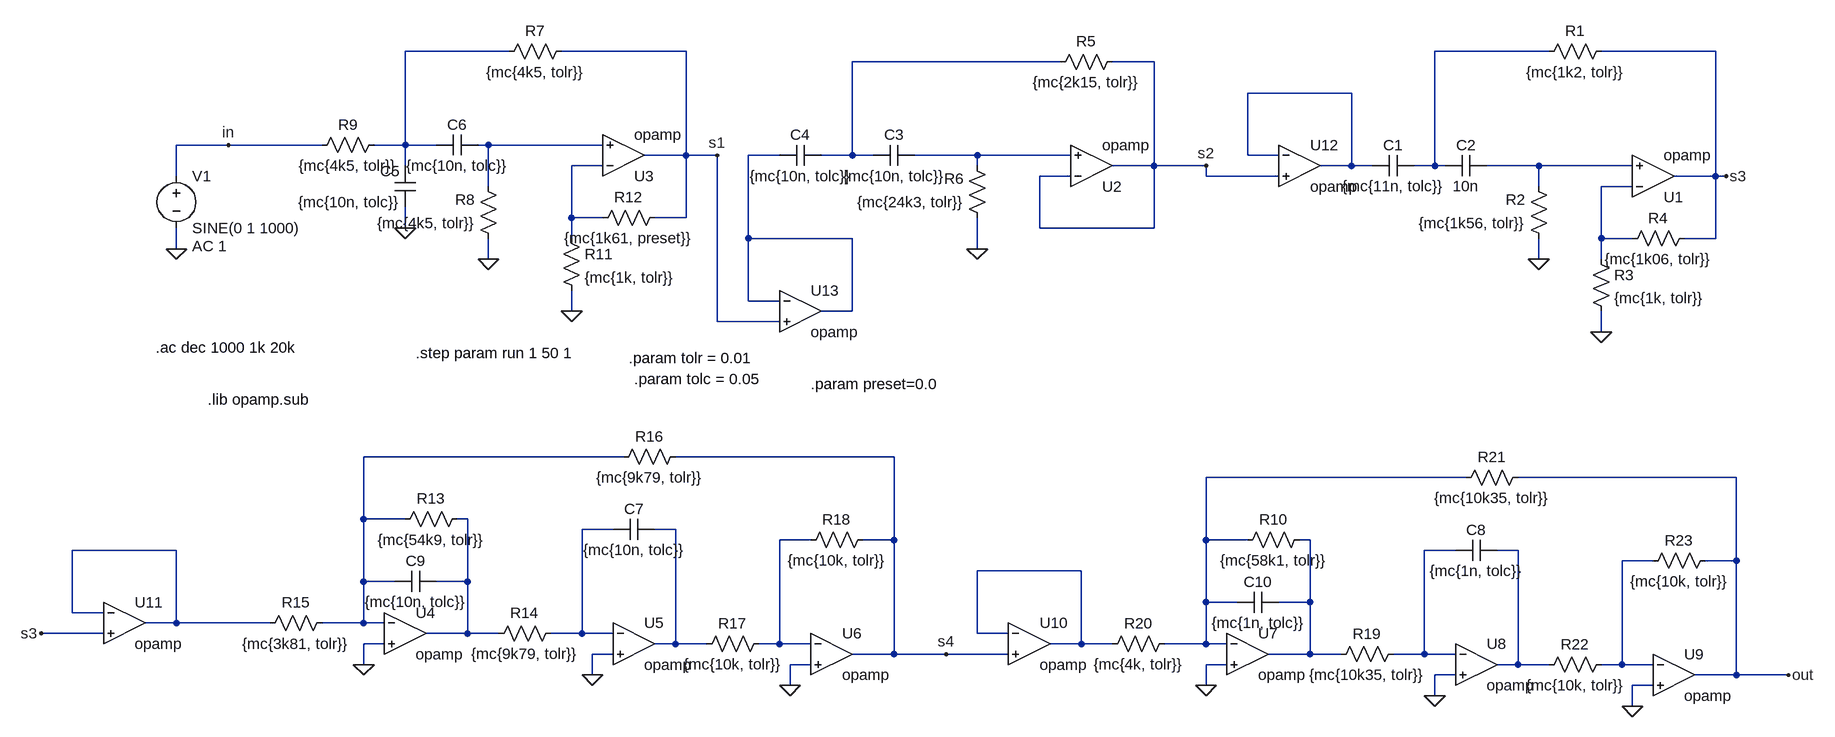
[diagram p0: schematic filtro_final.asc]
filtro_final.asc, the LTspice schematic file:
Version 4
SHEET 1 1252 1168
WIRE -1424 -48 -1584 -48
WIRE -1152 -48 -1344 -48
WIRE 176 -48 0 -48
WIRE 432 -48 256 -48
WIRE -576 -32 -896 -32
WIRE -432 -32 -496 -32
WIRE -128 16 -288 16
WIRE -1856 96 -1936 96
WIRE -1712 96 -1856 96
WIRE -1584 96 -1584 -48
WIRE -1584 96 -1632 96
WIRE -1536 96 -1584 96
WIRE -1456 96 -1472 96
WIRE -1280 96 -1456 96
WIRE -1152 112 -1152 -48
WIRE -1152 112 -1216 112
WIRE -1104 112 -1152 112
WIRE -1008 112 -1056 112
WIRE -896 112 -896 -32
WIRE -896 112 -944 112
WIRE -864 112 -896 112
WIRE -704 112 -800 112
WIRE -560 112 -704 112
WIRE -288 112 -288 16
WIRE -240 112 -288 112
WIRE -1584 128 -1584 96
WIRE -1280 128 -1328 128
WIRE -704 128 -704 112
WIRE -432 128 -432 -32
WIRE -432 128 -496 128
WIRE -352 128 -432 128
WIRE -128 128 -128 16
WIRE -128 128 -176 128
WIRE -96 128 -128 128
WIRE 0 128 0 -48
WIRE 0 128 -32 128
WIRE 16 128 0 128
WIRE 160 128 80 128
WIRE 304 128 160 128
WIRE -1936 144 -1936 96
WIRE -560 144 -608 144
WIRE -352 144 -352 128
WIRE -240 144 -352 144
WIRE 432 144 432 -48
WIRE 432 144 368 144
WIRE 448 144 432 144
WIRE -1456 160 -1456 96
WIRE 160 160 160 128
WIRE 304 160 256 160
WIRE -1328 208 -1328 128
WIRE -1280 208 -1328 208
WIRE -1152 208 -1152 112
WIRE -1152 208 -1200 208
WIRE -1584 224 -1584 192
WIRE -608 224 -608 144
WIRE -432 224 -432 128
WIRE -432 224 -608 224
WIRE -1328 240 -1328 208
WIRE -1056 240 -1056 112
WIRE -896 240 -1056 240
WIRE 256 240 256 160
WIRE 304 240 256 240
WIRE 432 240 432 144
WIRE 432 240 384 240
WIRE -1936 256 -1936 224
WIRE -704 256 -704 208
WIRE -1456 272 -1456 240
WIRE 160 272 160 240
WIRE 256 272 256 240
WIRE -1056 336 -1056 240
WIRE -1008 336 -1056 336
WIRE -1328 352 -1328 320
WIRE -896 352 -896 240
WIRE -896 352 -944 352
WIRE -1104 368 -1104 112
WIRE -1008 368 -1104 368
WIRE 256 384 256 352
WIRE -1248 576 -1648 576
WIRE -832 576 -1168 576
WIRE 48 608 -352 608
WIRE 464 608 128 608
WIRE -1648 672 -1648 576
WIRE -1584 672 -1648 672
WIRE -1488 672 -1504 672
WIRE -1264 688 -1312 688
WIRE -1168 688 -1200 688
WIRE -960 704 -1008 704
WIRE -832 704 -832 576
WIRE -832 704 -880 704
WIRE -352 704 -352 608
WIRE -288 704 -352 704
WIRE -192 704 -208 704
WIRE -1936 720 -2096 720
WIRE 32 720 -16 720
WIRE 128 720 96 720
WIRE 336 736 288 736
WIRE 464 736 464 608
WIRE 464 736 416 736
WIRE -544 752 -704 752
WIRE -1648 768 -1648 672
WIRE -1600 768 -1648 768
WIRE -1488 768 -1488 672
WIRE -1488 768 -1536 768
WIRE -352 800 -352 704
WIRE -304 800 -352 800
WIRE -192 800 -192 704
WIRE -192 800 -240 800
WIRE -2096 816 -2096 720
WIRE -2048 816 -2096 816
WIRE -1936 832 -1936 720
WIRE -1936 832 -1984 832
WIRE -1792 832 -1936 832
WIRE -1648 832 -1648 768
WIRE -1648 832 -1712 832
WIRE -1616 832 -1648 832
WIRE -2048 848 -2144 848
WIRE -1488 848 -1488 768
WIRE -1488 848 -1552 848
WIRE -1440 848 -1488 848
WIRE -1312 848 -1312 688
WIRE -1312 848 -1360 848
WIRE -1264 848 -1312 848
WIRE -704 848 -704 752
WIRE -656 848 -704 848
WIRE -1616 864 -1648 864
WIRE -1168 864 -1168 688
WIRE -1168 864 -1200 864
WIRE -1120 864 -1168 864
WIRE -1008 864 -1008 704
WIRE -1008 864 -1040 864
WIRE -960 864 -1008 864
WIRE -544 864 -544 752
WIRE -544 864 -592 864
WIRE -496 864 -544 864
WIRE -352 864 -352 800
WIRE -352 864 -416 864
WIRE -320 864 -352 864
WIRE -1264 880 -1296 880
WIRE -832 880 -832 704
WIRE -832 880 -896 880
WIRE -752 880 -832 880
WIRE -656 880 -752 880
WIRE -192 880 -192 800
WIRE -192 880 -256 880
WIRE -144 880 -192 880
WIRE -16 880 -16 720
WIRE -16 880 -64 880
WIRE 32 880 -16 880
WIRE -1648 896 -1648 864
WIRE -960 896 -992 896
WIRE -320 896 -352 896
WIRE 128 896 128 720
WIRE 128 896 96 896
WIRE 176 896 128 896
WIRE 288 896 288 736
WIRE 288 896 256 896
WIRE 336 896 288 896
WIRE -1296 912 -1296 880
WIRE 32 912 0 912
WIRE 464 912 464 736
WIRE 464 912 400 912
WIRE 544 912 464 912
WIRE -992 928 -992 896
WIRE -352 928 -352 896
WIRE 336 928 304 928
WIRE 0 944 0 912
WIRE 304 960 304 928
FLAG 256 384 0
FLAG 160 272 0
FLAG -704 256 0
FLAG -1328 352 0
FLAG -1584 224 0
FLAG -1456 272 0
FLAG -1936 256 0
FLAG -352 128 s2
FLAG 448 144 s3
FLAG -1648 896 0
FLAG -1296 912 0
FLAG -992 928 0
FLAG -752 880 s4
FLAG -1856 96 in
FLAG -352 928 0
FLAG 0 944 0
FLAG 304 960 0
FLAG 544 912 out
FLAG -2144 848 s3
FLAG -1104 112 s1
SYMBOL res 272 -64 R90
WINDOW 0 0 56 VBottom 2
WINDOW 3 32 56 VTop 2
SYMATTR InstName R1
SYMATTR Value {mc{1k2, tolr}}
SYMBOL res 176 256 R180
WINDOW 0 36 76 Left 2
WINDOW 3 36 40 Left 2
SYMATTR InstName R2
SYMATTR Value {mc{1k56, tolr}}
SYMBOL cap -32 112 R90
WINDOW 0 0 32 VBottom 2
WINDOW 3 32 32 VTop 2
SYMATTR InstName C1
SYMATTR Value {mc{11n, tolc}}
SYMBOL cap 80 112 R90
WINDOW 0 0 32 VBottom 2
WINDOW 3 32 32 VTop 2
SYMATTR InstName C2
SYMATTR Value 10n
SYMBOL Opamps\\opamp 336 208 M180
SYMATTR InstName U1
SYMBOL res 240 256 R0
SYMATTR InstName R3
SYMATTR Value {mc{1k, tolr}}
SYMBOL res 400 224 R90
WINDOW 0 0 56 VBottom 2
WINDOW 3 32 56 VTop 2
SYMATTR InstName R4
SYMATTR Value {mc{1k06, tolr}}
SYMBOL res -480 -48 R90
WINDOW 0 0 56 VBottom 2
WINDOW 3 32 56 VTop 2
SYMATTR InstName R5
SYMATTR Value {mc{2k15, tolr}}
SYMBOL res -688 224 R180
WINDOW 0 36 76 Left 2
WINDOW 3 36 40 Left 2
SYMATTR InstName R6
SYMATTR Value {mc{24k3, tolr}}
SYMBOL cap -800 96 R90
WINDOW 0 0 32 VBottom 2
WINDOW 3 32 32 VTop 2
SYMATTR InstName C3
SYMATTR Value {mc{10n, tolc}}
SYMBOL cap -944 96 R90
WINDOW 0 0 32 VBottom 2
WINDOW 3 32 32 VTop 2
SYMATTR InstName C4
SYMATTR Value {mc{10n, tolc}}
SYMBOL Opamps\\opamp -528 192 M180
SYMATTR InstName U2
SYMBOL res -1616 80 R90
WINDOW 0 0 56 VBottom 2
WINDOW 3 32 56 VTop 2
SYMATTR InstName R9
SYMATTR Value {mc{4k5, tolr}}
SYMBOL Opamps\\opamp -1248 176 M180
SYMATTR InstName U3
SYMBOL res -1344 224 R0
SYMATTR InstName R11
SYMATTR Value {mc{1k, tolr}}
SYMBOL res -1184 192 R90
WINDOW 0 0 56 VBottom 2
WINDOW 3 32 56 VTop 2
SYMATTR InstName R12
SYMATTR Value {mc{1k61, preset}}
SYMBOL cap -1568 192 R180
WINDOW 0 24 56 Left 2
WINDOW 3 24 8 Left 2
SYMATTR InstName C5
SYMATTR Value {mc{10n, tolc}}
SYMBOL cap -1536 112 R270
WINDOW 0 32 32 VTop 2
WINDOW 3 0 32 VBottom 2
SYMATTR InstName C6
SYMATTR Value {mc{10n, tolc}}
SYMBOL res -1328 -64 R90
WINDOW 0 0 56 VBottom 2
WINDOW 3 32 56 VTop 2
SYMATTR InstName R7
SYMATTR Value {mc{4k5, tolr}}
SYMBOL res -1440 256 R180
WINDOW 0 36 76 Left 2
WINDOW 3 36 40 Left 2
SYMATTR InstName R8
SYMATTR Value {mc{4k5, tolr}}
SYMBOL voltage -1936 128 R0
WINDOW 123 24 124 Left 2
WINDOW 39 0 0 Left 0
SYMATTR Value2 AC 1
SYMATTR InstName V1
SYMATTR Value SINE(0 1 1000)
SYMBOL res -1488 656 R90
WINDOW 0 0 56 VBottom 2
WINDOW 3 32 56 VTop 2
SYMATTR InstName R13
SYMATTR Value {mc{54k9, tolr}}
SYMBOL res -1344 832 R90
WINDOW 0 0 56 VBottom 2
WINDOW 3 32 56 VTop 2
SYMATTR InstName R14
SYMATTR Value {mc{9k79, tolr}}
SYMBOL res -1696 816 R90
WINDOW 0 0 56 VBottom 2
WINDOW 3 32 56 VTop 2
SYMATTR InstName R15
SYMATTR Value {mc{3k81, tolr}}
SYMBOL res -1152 560 R90
WINDOW 0 0 56 VBottom 2
WINDOW 3 32 56 VTop 2
SYMATTR InstName R16
SYMATTR Value {mc{9k79, tolr}}
SYMBOL res -1024 848 R90
WINDOW 0 0 56 VBottom 2
WINDOW 3 32 56 VTop 2
SYMATTR InstName R17
SYMATTR Value {mc{10k, tolr}}
SYMBOL cap -1200 672 R90
WINDOW 0 0 32 VBottom 2
WINDOW 3 32 32 VTop 2
SYMATTR InstName C7
SYMATTR Value {mc{10n, tolc}}
SYMBOL Opamps\\opamp -1584 784 R0
SYMATTR InstName U4
SYMBOL Opamps\\opamp -1232 800 R0
SYMATTR InstName U5
SYMBOL Opamps\\opamp -928 816 R0
SYMATTR InstName U6
SYMBOL cap -1536 752 R90
WINDOW 0 0 32 VBottom 2
WINDOW 3 32 32 VTop 2
SYMATTR InstName C9
SYMATTR Value {mc{10n, tolc}}
SYMBOL res -864 688 R90
WINDOW 0 0 56 VBottom 2
WINDOW 3 32 56 VTop 2
SYMATTR InstName R18
SYMATTR Value {mc{10k, tolr}}
SYMBOL res -192 688 R90
WINDOW 0 0 56 VBottom 2
WINDOW 3 32 56 VTop 2
SYMATTR InstName R10
SYMATTR Value {mc{58k1, tolr}}
SYMBOL res -48 864 R90
WINDOW 0 0 56 VBottom 2
WINDOW 3 32 56 VTop 2
SYMATTR InstName R19
SYMATTR Value {mc{10k35, tolr}}
SYMBOL res -400 848 R90
WINDOW 0 0 56 VBottom 2
WINDOW 3 32 56 VTop 2
SYMATTR InstName R20
SYMATTR Value {mc{4k, tolr}}
SYMBOL res 144 592 R90
WINDOW 0 0 56 VBottom 2
WINDOW 3 32 56 VTop 2
SYMATTR InstName R21
SYMATTR Value {mc{10k35, tolr}}
SYMBOL res 272 880 R90
WINDOW 0 0 56 VBottom 2
WINDOW 3 32 56 VTop 2
SYMATTR InstName R22
SYMATTR Value {mc{10k, tolr}}
SYMBOL cap 96 704 R90
WINDOW 0 0 32 VBottom 2
WINDOW 3 32 32 VTop 2
SYMATTR InstName C8
SYMATTR Value {mc{1n, tolc}}
SYMBOL Opamps\\opamp -288 816 R0
SYMATTR InstName U7
SYMBOL Opamps\\opamp 64 832 R0
SYMATTR InstName U8
SYMBOL Opamps\\opamp 368 848 R0
SYMATTR InstName U9
SYMBOL cap -240 784 R90
WINDOW 0 0 32 VBottom 2
WINDOW 3 32 32 VTop 2
SYMATTR InstName C10
SYMATTR Value {mc{1n, tolc}}
SYMBOL res 432 720 R90
WINDOW 0 0 56 VBottom 2
WINDOW 3 32 56 VTop 2
SYMATTR InstName R23
SYMATTR Value {mc{10k, tolr}}
SYMBOL Opamps\\opamp -624 800 R0
SYMATTR InstName U10
SYMBOL Opamps\\opamp -2016 768 R0
SYMATTR InstName U11
SYMBOL Opamps\\opamp -208 64 R0
SYMATTR InstName U12
SYMBOL Opamps\\opamp -976 288 R0
SYMATTR InstName U13
TEXT -1968 408 Left 2 !.ac dec 1000 1k 20k
TEXT -1888 488 Left 2 !.lib opamp.sub
TEXT -1568 416 Left 2 !.step param run 1 50 1
TEXT -1240 424 Left 2 !.param tolr = 0.01
TEXT -1232 456 Left 2 !.param tolc = 0.05
TEXT -960 464 Left 2 !.param preset=0.0

The netlist it stands for:
* filtro_final.asc
R1 s3 N002 {mc{1k2, tolr}}
R2 0 N009 {mc{1k56, tolr}}
C1 N002 N004 {mc{11n, tolc}}
C2 N009 N002 10n
XU1 N010 N009 s3 opamp Aol=100K GBW=10Meg  ; pins invin noninvin out
R3 N010 0 {mc{1k, tolr}}
R4 s3 N010 {mc{1k06, tolr}}
R5 s2 N003 {mc{2k15, tolr}}
R6 0 N007 {mc{24k3, tolr}}
C3 N007 N003 {mc{10n, tolc}}
C4 N003 N006 {mc{10n, tolc}}
XU2 s2 N007 s2 opamp Aol=100K GBW=10Meg  ; pins invin noninvin out
R9 N001 in {mc{4k5, tolr}}
XU3 N008 N005 s1 opamp Aol=100K GBW=10Meg  ; pins invin noninvin out
R11 N008 0 {mc{1k, tolr}}
R12 s1 N008 {mc{1k61, preset}}
C5 0 N001 {mc{10n, tolc}}
C6 N001 N005 {mc{10n, tolc}}
R7 s1 N001 {mc{4k5, tolr}}
R8 0 N005 {mc{4k5, tolr}}
V1 in 0 SINE(0 1 1000) AC 1
R13 N013 N011 {mc{54k9, tolr}}
R14 N014 N013 {mc{9k79, tolr}}
R15 N011 N018 {mc{3k81, tolr}}
R16 s4 N011 {mc{9k79, tolr}}
R17 N016 N015 {mc{10k, tolr}}
C7 N015 N014 {mc{10n, tolc}}
XU4 N011 0 N013 opamp Aol=100K GBW=10Meg  ; pins invin noninvin out
XU5 N014 0 N015 opamp Aol=100K GBW=10Meg  ; pins invin noninvin out
XU6 N016 0 s4 opamp Aol=100K GBW=10Meg  ; pins invin noninvin out
C9 N013 N011 {mc{10n, tolc}}
R18 s4 N016 {mc{10k, tolr}}
R10 N017 N012 {mc{58k1, tolr}}
R19 N019 N017 {mc{10k35, tolr}}
R20 N012 N022 {mc{4k, tolr}}
R21 out N012 {mc{10k35, tolr}}
R22 N021 N020 {mc{10k, tolr}}
C8 N020 N019 {mc{1n, tolc}}
XU7 N012 0 N017 opamp Aol=100K GBW=10Meg  ; pins invin noninvin out
XU8 N019 0 N020 opamp Aol=100K GBW=10Meg  ; pins invin noninvin out
XU9 N021 0 out opamp Aol=100K GBW=10Meg  ; pins invin noninvin out
C10 N017 N012 {mc{1n, tolc}}
R23 out N021 {mc{10k, tolr}}
XU10 N022 s4 N022 opamp Aol=100K GBW=10Meg  ; pins invin noninvin out
XU11 N018 s3 N018 opamp Aol=100K GBW=10Meg  ; pins invin noninvin out
XU12 N004 s2 N004 opamp Aol=100K GBW=10Meg  ; pins invin noninvin out
XU13 N006 s1 N006 opamp Aol=100K GBW=10Meg  ; pins invin noninvin out
.ac dec 1000 1k 20k
.lib opamp.sub
.step param run 1 50 1
.param tolr = 0.01
.param tolc = 0.05
.param preset=0.0
.backanno
.end